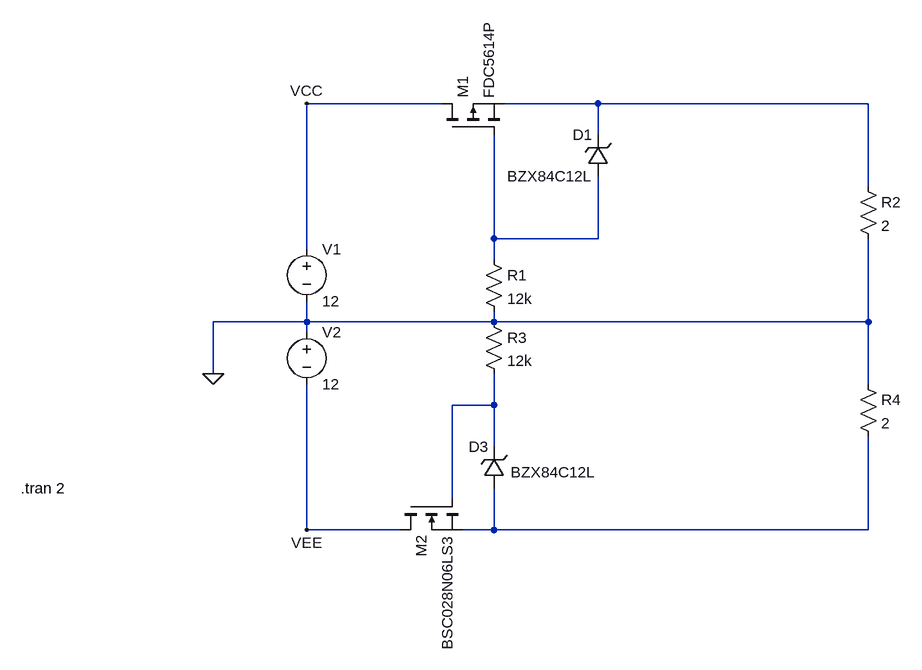
[diagram p0: schematic ReversePolarityProtection.asc]
ReversePolarityProtection.asc, the LTspice schematic file:
Version 4
SHEET 1 1044 824
WIRE 336 -16 128 -16
WIRE 576 -16 432 -16
WIRE 992 -16 576 -16
WIRE 576 32 576 -16
WIRE 992 112 992 -16
WIRE 416 192 416 32
WIRE 576 192 576 96
WIRE 576 192 416 192
WIRE 128 208 128 -16
WIRE 416 224 416 192
WIRE 128 320 128 288
WIRE 128 320 -16 320
WIRE 416 320 416 304
WIRE 416 320 128 320
WIRE 992 320 992 192
WIRE 992 320 416 320
WIRE 128 336 128 320
WIRE -16 400 -16 320
WIRE 992 416 992 320
WIRE 416 448 416 400
WIRE 416 448 352 448
WIRE 416 512 416 448
WIRE 352 592 352 448
WIRE 128 640 128 416
WIRE 272 640 128 640
WIRE 416 640 416 576
WIRE 416 640 368 640
WIRE 992 640 992 496
WIRE 992 640 416 640
FLAG -16 400 0
FLAG 128 -16 VCC
FLAG 128 640 VEE
SYMBOL voltage 128 192 R0
SYMATTR InstName V1
SYMATTR Value 12
SYMBOL voltage 128 320 R0
SYMATTR InstName V2
SYMATTR Value 12
SYMBOL zener 592 96 R180
WINDOW 0 24 64 Left 2
WINDOW 3 24 0 Left 2
SYMATTR InstName D1
SYMATTR Value BZX84C12L
SYMBOL pmos 336 32 R270
SYMATTR InstName M1
SYMATTR Value FDC5614P
SYMBOL res 400 208 R0
SYMATTR InstName R1
SYMATTR Value 12k
SYMBOL res 976 96 R0
SYMATTR InstName R2
SYMATTR Value 2
SYMBOL nmos 272 592 M90
SYMATTR InstName M2
SYMATTR Value BSC028N06LS3
SYMBOL res 400 304 R0
SYMATTR InstName R3
SYMATTR Value 12k
SYMBOL zener 432 576 R180
WINDOW 0 24 64 Left 2
WINDOW 3 -141 25 Left 2
SYMATTR InstName D3
SYMATTR Value BZX84C12L
SYMBOL res 976 400 R0
SYMATTR InstName R4
SYMATTR Value 2
TEXT -312 576 Left 2 !.tran 2

The netlist it stands for:
* ReversePolarityProtection.asc
V1 VCC 0 12
V2 0 VEE 12
D1 N002 N001 BZX84C12L
M1 VCC N002 N001 N001 FDC5614P
R1 N002 0 12k
R2 N001 0 2
M2 VEE N003 N004 N004 BSC028N06LS3
R3 0 N003 12k
D3 N004 N003 BZX84C12L
R4 0 N004 2
.model D D
.lib standard.dio
.model NMOS NMOS
.model PMOS PMOS
.lib standard.mos
.tran 2
.backanno
.end